# Altium project main_pcb.PrjPcb
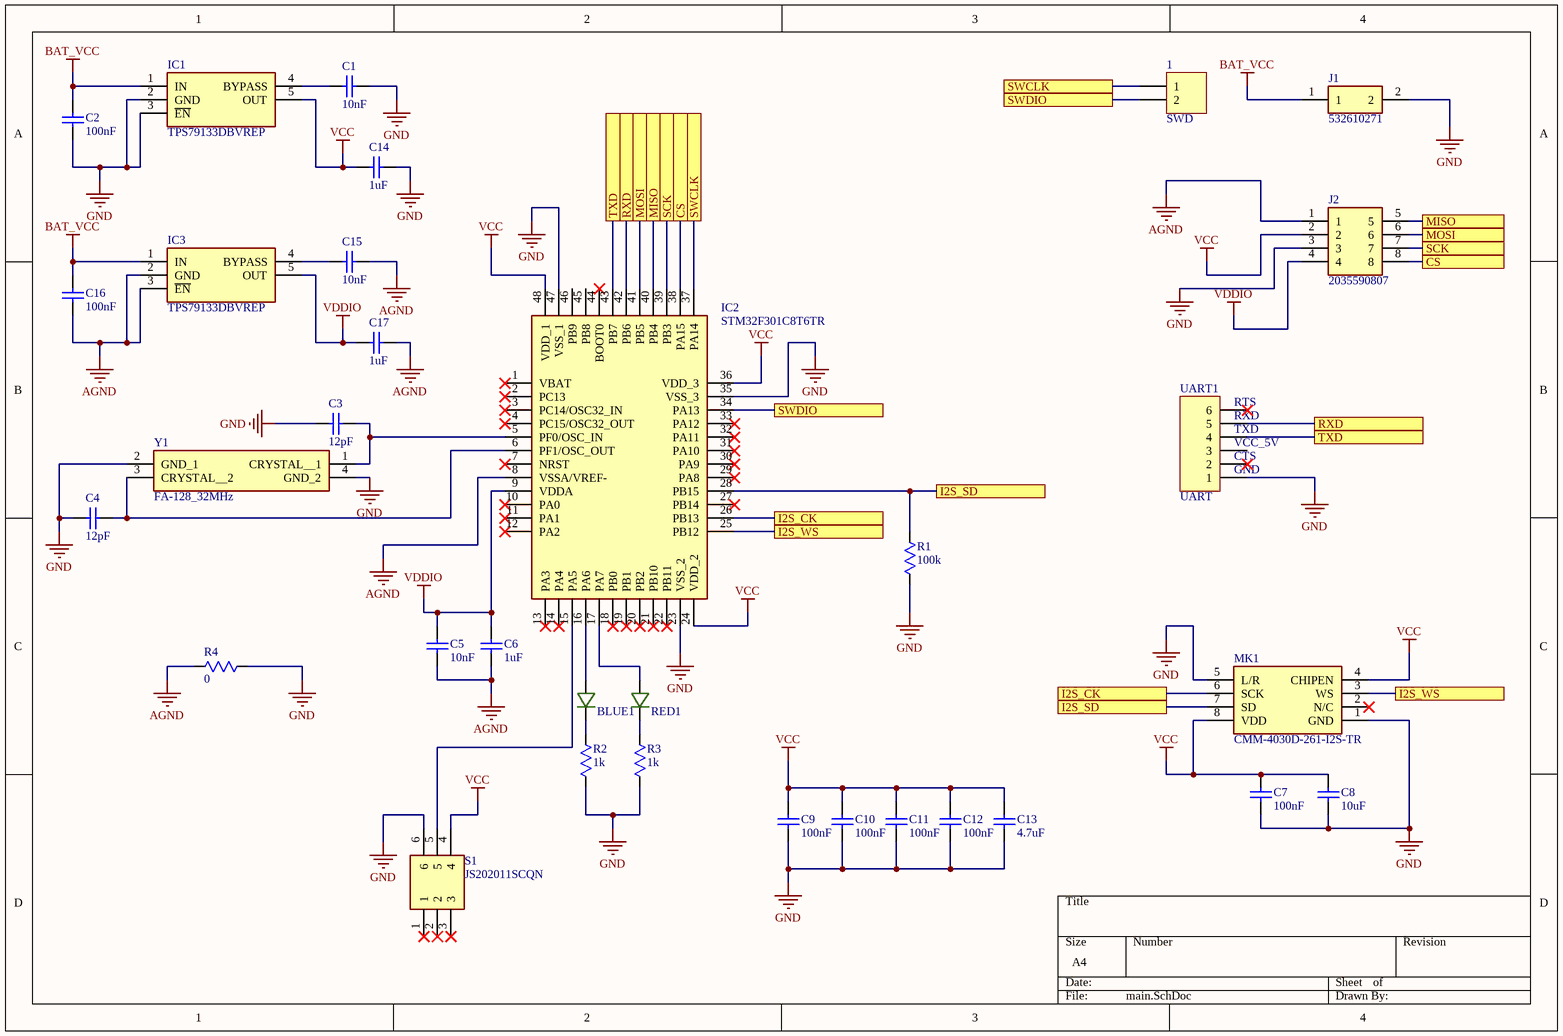
[diagram p0: main.SchDoc]
1 sheet, 33 parts. Net scope: flat (ports and power ports of the same name join across sheets).
Board file: main.PcbDoc

## Sheet main.SchDoc
size A4

### Parts
1  SWD  [HDR1X2]
BLUE1  LG_L29K  [OSRAM LG L29K]  (value not drawn)
C1  10nF  [CAP_2012]
C2  100nF  [CAP_2012]
C3  12pF  [CAP_2012]
C4  12pF  [CAP_2012]
C5  10nF  [CAP_2012]
C6  1uF  [CAP_2012]
C7  100nF  [CAP_2012]
C8  10uF  [CAP_2012]
C9  100nF  [CAP_2012]
C10  100nF  [CAP_2012]
C11  100nF  [CAP_2012]
C12  100nF  [CAP_2012]
C13  4.7uF  [CAP_2012]
C14  1uF  [CAP_2012]
C15  10nF  [CAP_2012]
C16  100nF  [CAP_2012]
C17  1uF  [CAP_2012]
IC1  TPS79133DBVREP  [SOT95P280X145-5N]
IC2  STM32F301C8T6TR  [QFP50P900X900X160-48N]
IC3  TPS79133DBVREP  [SOT95P280X145-5N]
J1  532610271  [532610271]
J2  2035590807  [2035590807]
MK1  CMM-4030D-261-I2S-TR  [CMM4030D261I2STR]
R1  100k  [RES_2012]
R2  1k  [RES_2012]
R3  1k  [RES_2012]
R4  0  [RES_2012]
RED1  LG_L29K  [OSRAM LG L29K]  (value not drawn)
S1  JS202011SCQN  [JS202011SCQN]
UART1  UART  [HDR1X6]
Y1  FA-128_32MHz  [FA128480000MF20XK]

### Ports
CS, I2S_CK, I2S_SD, I2S_WS, MISO, MOSI, RXD, SCK, SWCLK, SWDIO, TXD

### Nets
AGND: C5.1 C6.1 C15.1 C16.1 C17.1 IC2.8(VSSA/VREF-) IC3.2(GND) IC3.3(~{EN}) J2.1 R4.2
BAT_VCC: C2.2 C16.2 IC1.1(IN) IC3.1(IN) J1.1
GND: C1.1 C2.1 C3.2 C4.2 C7.1 C8.1 C9.1 C10.1 C11.1 C12.1 C13.1 C14.1 IC1.2(GND) IC1.3(~{EN}) IC2.23(VSS_2) IC2.35(VSS_3) IC2.47(VSS_1) J1.2 J2.3 MK1.1(GND) MK1.5(L/R) R1.1 R2.1 R3.1 R4.1 S1.6 UART1.1 Y1.2(GND_1) Y1.4(GND_2)
VCC: C7.2 C8.2 C9.2 C10.2 C11.2 C12.2 C13.2 C14.2 IC1.5(OUT) IC2.24(VDD_2) IC2.36(VDD_3) IC2.48(VDD_1) J2.2 MK1.4(CHIPEN) MK1.8(VDD) S1.4
VDDIO: C5.2 C6.2 C17.2 IC2.9(VDDA) IC3.5(OUT) J2.4
Net1_1: 1.1 IC2.37(PA14) ; port SWCLK
Net1_2: 1.2 IC2.34(PA13) ; port SWDIO
NetBLUE1_1: BLUE1.1(C) R2.2
NetBLUE1_2: BLUE1.2(A) IC2.16(PA6)
NetC1_2: C1.2 IC1.4(BYPASS)
NetC3_1: C3.1 IC2.5(PF0/OSC_IN) Y1.1(CRYSTAL__1)
NetC4_1: C4.1 IC2.6(PF1/OSC_OUT) Y1.3(CRYSTAL__2)
NetC15_2: C15.2 IC3.4(BYPASS)
NetIC2_15: IC2.15(PA5) S1.5
NetIC2_17: IC2.17(PA7) RED1.2(A)
NetIC2_25: IC2.25(PB12) MK1.3(WS) ; port I2S_WS
NetIC2_26: IC2.26(PB13) MK1.6(SCK) ; port I2S_CK
NetIC2_28: IC2.28(PB15) MK1.7(SD) R1.2 ; port I2S_SD
NetIC2_38: IC2.38(PA15) J2.8 ; port CS
NetIC2_39: IC2.39(PB3) J2.7 ; port SCK
NetIC2_40: IC2.40(PB4) J2.5 ; port MISO
NetIC2_41: IC2.41(PB5) J2.6 ; port MOSI
NetIC2_42: IC2.42(PB6) UART1.5 ; port RXD
NetIC2_43: IC2.43(PB7) UART1.4 ; port TXD
NetR3_2: R3.2 RED1.1(C)

Not connected (* = marked no-connect by the designer): IC2 1(VBAT)* 2(PC13)* 3(PC14/OSC32_IN)* 4(PC15/OSC32_OUT)* 7(NRST)* 10(PA0)* 11(PA1)* 12(PA2)* 13(PA3)* 14(PA4)* 18(PB0)* 19(PB1)* 20(PB2)* 21(PB10)* 22(PB11)* 27(PB14)* 29(PA8)* 30(PA9)* 31(PA10)* 32(PA11)* 33(PA12)* 44(BOOT0)* 45(PB8) 46(PB9); MK1 2(N/C)*; S1 1* 2* 3*; UART1 2* 3 6*

### Notes on the sheet
- (near UART1) RTS
- (near UART1) RXD
- (near UART1) TXD
- (near UART1) VCC_5V
- (near UART1) CTS
- (near UART1) GND

### Library data of the parts
1 = Header 2: Header, 2-Pin; LatestRevisionDate: 17-Jul-2002; LatestRevisionNote: Re-released for DXP Platform.; Publisher: Altium Limited
BLUE1 RED1 = LG_L29K: LED Uni-Color Green 572nm 2-Pin Chip 0603(1608Metric) T/R; Manufacturer 1: Osram Opto; Manufacturer Part Number 1: LGL29K-G2J1-24-Z; Lens Color: White; Forward Current: 20mA; Forward Voltage: 2.2V; Luminous Intensity: 5.6mcd; Viewing Angle: 160°; Number of LEDs: 1; Lens Style: Flat,Diffused,Colorless,Rectangular; Lens Transparency: Diffused; Reverse Voltage: 12V; Test Current: 2mA; Dominant Wavelength: 570nm; Luminous Flux: 0.012lm; Lens Size: 0.8mm; Supplier 1: Digi-Key; RoHS: Yes; Category: Uncategorized; Stock 1: 212666; Pricing 1: 1=0.42000, 10=0.30400, 100=0.19830, 500=0.14250, 1000=0.11153, 2500=0.10224 (USD); Mount: Surface Mount; Case/Package: 0603; Number of Pins: 2; Case Code (Imperial): 0603; Case Code (Metric): 1608; Color: Green; Min Operating Temperature: -40°C; Max Operating Temperature: 100°C; Illumination Color: Green; Packaging: Tape and Reel; Package Quantity: 5000; Number of Elements: 1; Length: 1.3mm; Height: 0.65mm; Width: 0.8mm; Depth: 0.8mm; Radiation Hardening: No; ComponentLink1URL: https://datasheet.ciiva.com/4689/g-l29k-39844-4689584.pdf?src-supplier=Mouser; ComponentLink1Description: https://datasheet.ciiva.com/4689/g-l29k-39844-4689584.pdf?src-supplier=Mouser; ComponentLink2URL: https://datasheet.ciiva.com/15198/getdatasheetpartid-571127-15198411.pdf?src-supplier=Verical; ComponentLink2Description: https://datasheet.ciiva.com/15198/getdatasheetpartid-571127-15198411.pdf?src-supplier=Verical; ComponentLink3URL: https://datasheet.ciiva.com/2112/00077107-0-2112886.pdf?src-supplier=Digi-Key; ComponentLink3Description: https://datasheet.ciiva.com/2112/00077107-0-2112886.pdf?src-supplier=Digi-Key; ComponentLink4URL: https://datasheet.ciiva.com/2112/00077107-0-2112887.pdf?src-supplier=Digi-Key; ComponentLink4Description: https://datasheet.ciiva.com/2112/00077107-0-2112887.pdf?src-supplier=Digi-Key; ComponentLink5URL: https://datasheet.ciiva.com/2112/00077107-0-2112888.pdf?src-supplier=Digi-Key; ComponentLink5Description: https://datasheet.ciiva.com/2112/00077107-0-2112888.pdf?src-supplier=Digi-Key
C1-C17 = CAP 2012: 2012(Metric) smd ceramic capacitor; Manufacturer 1: Walsin Technologies; Manufacturer Part Number 1: 0805F106Z100CT; Value: 100pF; Tolerance: 80%; Dielectric: Y5V; Voltage Rating: 10V; ComponentLink1URL: http://components.arrow.com/part/dataview/0323_00662210?src-supplier=Arrow+Europe; ComponentLink1Description: http://components.arrow.com/part/dataview/0323_00662210?src-supplier=Arrow+Europe; ComponentLink2URL: http://www.farnell.com/datasheets/1960319.pdf?src-supplier=Farnell; ComponentLink2Description: http://www.farnell.com/datasheets/1960319.pdf?src-supplier=Farnell; ComponentLink3URL: http://www.farnell.com/datasheets/1960319.pdf?src-supplier=Element14; ComponentLink3Description: http://www.farnell.com/datasheets/1960319.pdf?src-supplier=Element14; ComponentLink4URL: http://datasheet.octopart.com/WR08W4R70FTL-Walsin-Technologies-datasheet-48038251.pdf?src-supplier=Element14; ComponentLink4Description: http://datasheet.octopart.com/WR08W4R70FTL-Walsin-Technologies-datasheet-48038251.pdf?src-supplier=Element14; ComponentLink5URL: http://datasheet.octopart.com/WR08W4R70FTL-Walsin-Technologies-datasheet-32780790.pdf; ComponentLink5Description: http://datasheet.octopart.com/WR08W4R70FTL-Walsin-Technologies-datasheet-32780790.pdf; ComponentLink6URL: https://datasheet.ciiva.com/18163/getdatasheetpartid-414444-18163626.pdf?src-supplier=Verical; ComponentLink6Description: https://datasheet.ciiva.com/18163/getdatasheetpartid-414444-18163626.pdf?src-supplier=Verical; ComponentLink7URL: http://datasheet.octopart.com/0805F106Z100CT-Walsin-Technologies-datasheet-48038160.pdf?src-supplier=Element14; ComponentLink7Description: http://datasheet.octopart.com/0805F106Z100CT-Walsin-Technologies-datasheet-48038160.pdf?src-supplier=Element14; ComponentLink8URL: http://datasheet.octopart.com/0805F106Z100CT-Walsin-Technologies-datasheet-85392065.pdf?src-supplier=Element14; ComponentLink8Description: http://datasheet.octopart.com/0805F106Z100CT-Walsin-Technologies-datasheet-85392065.pdf?src-supplier=Element14; ComponentLink9URL: http://datasheet.octopart.com/0805F106Z100CT-Walsin-Technologies-datasheet-12512437.pdf?src-supplier=Future+Electronics; ComponentLink9Description: http://datasheet.octopart.com/0805F106Z100CT-Walsin-Technologies-datasheet-12512437.pdf?src-supplier=Future+Electronics; ComponentLink10URL: http://datasheet.octopart.com/0805F106Z100CT-Walsin-Technologies-datasheet-26371553.pdf?src-supplier=Future+Electronics; ComponentLink10Description: http://datasheet.octopart.com/0805F106Z100CT-Walsin-Technologies-datasheet-26371553.pdf?src-supplier=Future+Electronics; ComponentLink11URL: http://datasheet.octopart.com/0805F106Z100CT-Walsin-Technologies-datasheet-128065749.pdf?src-supplier=Future+Electronics; ComponentLink11Description: http://datasheet.octopart.com/0805F106Z100CT-Walsin-Technologies-datasheet-128065749.pdf?src-supplier=Future+Electronics; Supplier 1: Future Electronics; Stock 1: 99000; Pricing 1: 3000=0.03360, 6000=0.03000, 12000=0.02980, 15000=0.02970, 45000=0.02920 (USD); Case/Package: 0805; Case Code (Metric): 2012; Case Code (Imperial): 0805; Min Operating Temperature: -25°C; Max Operating Temperature: 85°C; Packaging: Tape and Reel; Voltage Rating (DC): 10V; Length: 2mm; Depth: 1.25mm; Radiation Hardening: No; REACH SVHC: Unknown; Lead Free: Lead Free
IC1 IC3 = TPS79133DBVREP: Integrated Circuit; Manufacturer_Name: Texas Instruments; Datasheet Link: http://www.ti.com/lit/gpn/tps79133-ep; Height: 1.45mm; Manufacturer_Part_Number: TPS79133DBVREP; Mouser Part Number: 595-TPS79133DBVREP; Mouser Price/Stock: https://www.mouser.co.uk/ProductDetail/Texas-Instruments/TPS79133DBVREP?qs=BBezV1N05%2Ft%252BRv0piYUUyA%3D%3D; Arrow Part Number: TPS79133DBVREP; Arrow Price/Stock: https://www.arrow.com/en/products/tps79133dbvrep/texas-instruments?region=nac
IC2 = STM32F301C8T6TR: Integrated Circuit; Manufacturer_Name: STMicroelectronics; Datasheet Link: https://componentsearchengine.com/Datasheets/2/STM32F301C8T6TR.pdf; Height: 1.6mm; Manufacturer_Part_Number: STM32F301C8T6TR; Mouser Part Number: 511-STM32F301C8T6TR; Mouser Price/Stock: https://www.mouser.co.uk/ProductDetail/STMicroelectronics/STM32F301C8T6TR?qs=qIaFMfck%2FPYy56%2F%252BEeuvMw%3D%3D; Arrow Part Number: STM32F301C8T6TR; Arrow Price/Stock: https://www.arrow.com/en/products/stm32f301c8t6tr/stmicroelectronics?region=nac
J1 = 532610271: Connector; Manufacturer_Name: Molex; Datasheet Link: https://www.molex.com/pdm_docs/sd/532610271_sd.pdf; Height: 3.4mm; Manufacturer_Part_Number: 532610271; Arrow Part Number: 532610271; Arrow Price/Stock: https://www.arrow.com/en/products/53261-0271/molex?region=nac
J2 = 2035590807: Connector; Manufacturer_Name: Molex; Datasheet Link: https://www.molex.com/pdm_docs/sd/2035590207_sd.pdf; Height: 3.2mm; Manufacturer_Part_Number: 2035590807
MK1 = CMM-4030D-261-I2S-TR: Microphone; Manufacturer_Name: CUI Inc.; Datasheet Link: https://www.mouser.co.uk/datasheet/2/670/cmm_4030d_261_i2s_tr-1892247.pdf; Height: 1.35mm; Manufacturer_Part_Number: CMM-4030D-261-I2S-TR; Mouser Part Number: 490-CMM4030D261I2STR; Mouser Price/Stock: https://www.mouser.co.uk/ProductDetail/CUI-Devices/CMM-4030D-261-I2S-TR?qs=hWgE7mdIu5S0cyoxFo6Z3Q%3D%3D
R1-R4 = RES 2012: 2012(Metric) smd resistor; Manufacturer_Part_Number: WR08X000 PTL; Manufacturer 1: Walsin Technologies; Manufacturer Part Number 1: WR08W4R70FTL; Vendor: Walsin; Built_By: EMA_Justin; Value: 100ohm; Power Rating: 125mW; Tolerance: 1%; Voltage Rating (DC): 150V; Temperature Coefficient: 400ppm/°C; Copyright: Copyright (C) 2016 Accelerated Designs. All rights reserved; RefDes: RefDes; Type: DEV; Supplier 1: Arrow; Stock 1: 60000; Pricing 1: 5000=0.00180 (USD); Mount: Surface Mount; Case/Package: 0805; Contact Material: Tin; Case Code (Metric): 2012; Case Code (Imperial): 0805; Packaging: Cut Tape; Composition: Thick Film; Voltage Rating: 150V; Lead Free: Lead Free; REACH SVHC: Unknown; ComponentLink1URL: http://components.arrow.com/part/dataview/0323_00662210?src-supplier=Arrow+Europe; ComponentLink1Description: http://components.arrow.com/part/dataview/0323_00662210?src-supplier=Arrow+Europe; ComponentLink2URL: http://www.farnell.com/datasheets/1960319.pdf?src-supplier=Farnell; ComponentLink2Description: http://www.farnell.com/datasheets/1960319.pdf?src-supplier=Farnell; ComponentLink3URL: http://www.farnell.com/datasheets/1960319.pdf?src-supplier=Element14; ComponentLink3Description: http://www.farnell.com/datasheets/1960319.pdf?src-supplier=Element14; ComponentLink4URL: http://datasheet.octopart.com/WR08W4R70FTL-Walsin-Technologies-datasheet-48038251.pdf?src-supplier=Element14; ComponentLink4Description: http://datasheet.octopart.com/WR08W4R70FTL-Walsin-Technologies-datasheet-48038251.pdf?src-supplier=Element14; ComponentLink5URL: http://datasheet.octopart.com/WR08W4R70FTL-Walsin-Technologies-datasheet-32780790.pdf; ComponentLink5Description: http://datasheet.octopart.com/WR08W4R70FTL-Walsin-Technologies-datasheet-32780790.pdf
S1 = JS202011SCQN: Switch; Manufacturer_Name: C & K COMPONENTS; Datasheet Link: https://www.ckswitches.com/media/1422/js.pdf; Height: 5.5mm; Manufacturer_Part_Number: JS202011SCQN; Mouser Part Number: 611-JS202011SCQN; Mouser Price/Stock: https://www.mouser.co.uk/ProductDetail/CK/JS202011SCQN?qs=LgMIjt8LuD95JYWxZ7NvZA%3D%3D; Arrow Part Number: JS202011SCQN; Arrow Price/Stock: https://www.arrow.com/en/products/js202011scqn/ck?region=nac
UART1 = Header 6: Header, 6-Pin; LatestRevisionDate: 17-Jul-2002; LatestRevisionNote: Re-released for DXP Platform.; Publisher: Altium Limited
Y1 = FA-128_48.0000MF20X-K: Crystal or Oscillator; Manufacturer_Name: Epson Timing; Manufacturer_Part_Number: FA-128 48.0000MF20X-K; Datasheet Link: https://componentsearchengine.com/Datasheets/1/FA-128 48.0000MF20X-K.pdf; Height: 0.5mm; Mouser Part Number: 732-FA-12848F20X-K; Mouser Price/Stock: https://www.mouser.com/Search/Refine.aspx?Keyword=732-FA-12848F20X-K